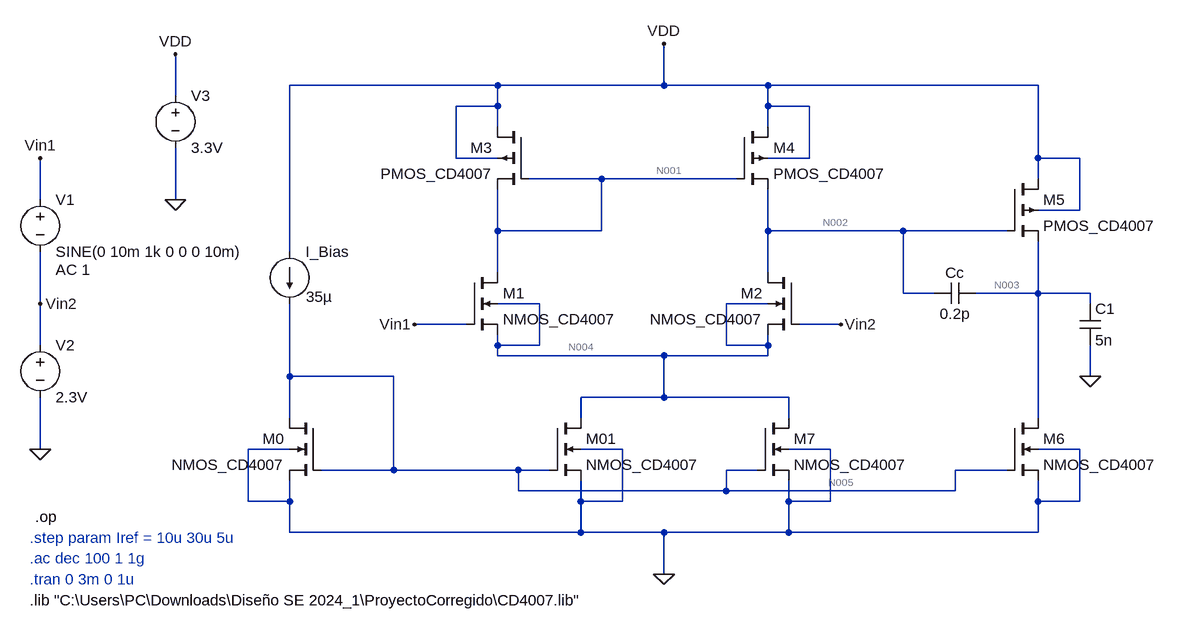
[diagram p0: schematic OTA_ADD_CurrentMirror.asc]
OTA_ADD_CurrentMirror.asc, the LTspice schematic file:
Version 4
SHEET 1 1976 948
WIRE 928 -64 608 -64
WIRE 1184 -64 1184 -128
WIRE 1184 -64 928 -64
WIRE 1344 -64 1184 -64
WIRE 1760 -64 1344 -64
WIRE 432 -48 432 -112
WIRE 928 -32 928 -64
WIRE 928 -32 864 -32
WIRE 1344 -32 1344 -64
WIRE 1408 -32 1344 -32
WIRE 928 0 928 -32
WIRE 1344 0 1344 -32
WIRE 864 48 864 -32
WIRE 928 48 864 48
WIRE 1408 48 1408 -32
WIRE 1408 48 1344 48
WIRE 1760 48 1760 -64
WIRE 1824 48 1760 48
WIRE 1088 80 976 80
WIRE 1296 80 1088 80
WIRE 1760 80 1760 48
WIRE 224 112 224 48
WIRE 432 112 432 32
WIRE 1824 128 1824 48
WIRE 1824 128 1760 128
WIRE 928 160 928 96
WIRE 1088 160 1088 80
WIRE 1088 160 928 160
WIRE 1344 160 1344 96
WIRE 1552 160 1344 160
WIRE 1712 160 1552 160
WIRE 608 192 608 -64
WIRE 928 224 928 160
WIRE 1344 224 1344 160
WIRE 1552 256 1552 160
WIRE 1600 256 1552 256
WIRE 1760 256 1760 176
WIRE 1760 256 1664 256
WIRE 1840 256 1760 256
WIRE 224 272 224 192
WIRE 992 272 928 272
WIRE 1344 272 1280 272
WIRE 1840 272 1840 256
WIRE 880 304 800 304
WIRE 1456 304 1392 304
WIRE 224 336 224 272
WIRE 928 336 928 320
WIRE 992 336 992 272
WIRE 992 336 928 336
WIRE 1280 336 1280 272
WIRE 1344 336 1344 320
WIRE 1344 336 1280 336
WIRE 928 352 928 336
WIRE 1184 352 928 352
WIRE 1344 352 1344 336
WIRE 1344 352 1184 352
WIRE 608 384 608 272
WIRE 768 384 608 384
WIRE 1840 384 1840 336
WIRE 1184 416 1184 352
WIRE 1184 416 1056 416
WIRE 1376 416 1184 416
WIRE 608 448 608 384
WIRE 1056 448 1056 416
WIRE 1376 448 1376 416
WIRE 1760 448 1760 256
WIRE 224 496 224 416
WIRE 608 496 544 496
WIRE 1120 496 1056 496
WIRE 1440 496 1376 496
WIRE 1824 496 1760 496
WIRE 768 528 768 384
WIRE 768 528 656 528
WIRE 960 528 768 528
WIRE 1008 528 960 528
WIRE 1328 528 1280 528
WIRE 1712 528 1632 528
WIRE 960 560 960 528
WIRE 1280 560 1280 528
WIRE 1280 560 960 560
WIRE 1632 560 1632 528
WIRE 1632 560 1280 560
WIRE 544 576 544 496
WIRE 608 576 608 544
WIRE 608 576 544 576
WIRE 1056 576 1056 544
WIRE 1120 576 1120 496
WIRE 1120 576 1056 576
WIRE 1376 576 1376 544
WIRE 1440 576 1440 496
WIRE 1440 576 1376 576
WIRE 1760 576 1760 544
WIRE 1824 576 1824 496
WIRE 1824 576 1760 576
WIRE 608 624 608 576
WIRE 1056 624 1056 576
WIRE 1056 624 608 624
WIRE 1184 624 1056 624
WIRE 1376 624 1376 576
WIRE 1376 624 1184 624
WIRE 1760 624 1760 576
WIRE 1760 624 1376 624
WIRE 1184 688 1184 624
FLAG 1184 -128 VDD
FLAG 432 -112 VDD
FLAG 800 304 Vin1
FLAG 224 48 Vin1
FLAG 1456 304 Vin2
FLAG 224 272 Vin2
FLAG 432 112 0
FLAG 1184 688 0
FLAG 224 496 0
FLAG 1840 384 0
DATAFLAG 1184 352 ""
DATAFLAG 928 160 ""
DATAFLAG 1344 160 ""
DATAFLAG 608 384 ""
DATAFLAG 1280 560 ""
DATAFLAG 1536 160 ""
DATAFLAG 848 304 ""
DATAFLAG 1424 304 ""
DATAFLAG 1760 256 ""
SYMBOL nmos4 880 224 R0
SYMATTR InstName M1
SYMATTR Value NMOS_CD4007
SYMATTR Value2 L=5u W=170u Ad=8500p As=8500p Pd=440u Ps=440u NRD=0.1 NRS=0.1
SYMBOL nmos4 1392 224 M0
SYMATTR InstName M2
SYMATTR Value NMOS_CD4007
SYMATTR Value2 L=5u W=170u Ad=8500p As=8500p Pd=440u Ps=440u NRD=0.1 NRS=0.1
SYMBOL pmos4 976 0 M0
SYMATTR InstName M3
SYMATTR Value PMOS_CD4007
SYMATTR Value2 L=5u W=360u Ad=18000p As=18000p Pd=820u Ps=820u NRS=0.54 NRD=0.54
SYMBOL pmos4 1296 0 R0
SYMATTR InstName M4
SYMATTR Value PMOS_CD4007
SYMATTR Value2 L=5u W=360u Ad=18000p As=18000p Pd=820u Ps=820u NRS=0.54 NRD=0.54
SYMBOL pmos4 1712 80 R0
SYMATTR InstName M5
SYMATTR Value PMOS_CD4007
SYMATTR Value2 L=5u W=360u Ad=18000p As=18000p Pd=820u Ps=820u NRS=0.54 NRD=0.54
SYMBOL nmos4 1712 448 R0
SYMATTR InstName M6
SYMATTR Value NMOS_CD4007
SYMATTR Value2 L=5u W=170u Ad=8500p As=8500p Pd=440u Ps=440u NRD=0.1 NRS=0.1
SYMBOL nmos4 1328 448 R0
SYMATTR InstName M7
SYMATTR Value NMOS_CD4007
SYMATTR Value2 L=5u W=170u Ad=8500p As=8500p Pd=440u Ps=440u NRD=0.1 NRS=0.1
SYMBOL nmos4 656 448 M0
SYMATTR InstName M0
SYMATTR Value NMOS_CD4007
SYMATTR Value2 L=5u W=170u Ad=8500p As=8500p Pd=440u Ps=440u NRD=0.1 NRS=0.1
SYMBOL nmos4 1008 448 R0
SYMATTR InstName M01
SYMATTR Value NMOS_CD4007
SYMATTR Value2 L=5u W=170u Ad=8500p As=8500p Pd=440u Ps=440u NRD=0.1 NRS=0.1
SYMBOL cap 1664 240 R90
WINDOW 0 0 32 VBottom 2
WINDOW 3 32 32 VTop 2
SYMATTR InstName Cc
SYMATTR Value 0.2p
SYMBOL current 608 192 R0
WINDOW 3 25 69 Left 2
WINDOW 123 0 0 Left 0
WINDOW 39 0 0 Left 0
SYMATTR Value 35µ
SYMATTR InstName I_Bias
SYMBOL voltage 224 96 R0
WINDOW 123 24 124 Left 2
WINDOW 39 0 0 Left 0
SYMATTR Value2 AC 1
SYMATTR InstName V1
SYMATTR Value SINE(0 10m 1k 0 0 0 10m)
SYMBOL voltage 224 320 R0
WINDOW 123 24 124 Left 2
WINDOW 39 0 0 Left 0
SYMATTR InstName V2
SYMATTR Value 2.3V
SYMBOL voltage 432 -64 R0
WINDOW 123 0 0 Left 0
WINDOW 39 0 0 Left 0
SYMATTR InstName V3
SYMATTR Value 3.3V
SYMBOL cap 1824 272 R0
SYMATTR InstName C1
SYMATTR Value 5n
TEXT 208 728 Left 2 !.lib "C:\\Users\\PC\\Downloads\\Diseño SE 2024_1\\ProyectoCorregido\\CD4007.lib"
TEXT 208 696 Left 2 ;.tran 0 3m 0 1u
TEXT 208 664 Left 2 ;.ac dec 100 1 1g
TEXT 208 632 Left 2 ;.step param Iref = 10u 30u 5u
TEXT 216 600 Left 2 !.op

The netlist it stands for:
* OTA_ADD_CurrentMirror.asc
M1 N001 Vin1 N004 N004 NMOS_CD4007 L=5u W=170u Ad=8500p As=8500p Pd=440u Ps=440u NRD=0.1 NRS=0.1
M2 N002 Vin2 N004 N004 NMOS_CD4007 L=5u W=170u Ad=8500p As=8500p Pd=440u Ps=440u NRD=0.1 NRS=0.1
M3 VDD N001 N001 VDD PMOS_CD4007 L=5u W=360u Ad=18000p As=18000p Pd=820u Ps=820u NRS=0.54 NRD=0.54
M4 VDD N001 N002 VDD PMOS_CD4007 L=5u W=360u Ad=18000p As=18000p Pd=820u Ps=820u NRS=0.54 NRD=0.54
M5 VDD N002 N003 VDD PMOS_CD4007 L=5u W=360u Ad=18000p As=18000p Pd=820u Ps=820u NRS=0.54 NRD=0.54
M6 N003 N005 0 0 NMOS_CD4007 L=5u W=170u Ad=8500p As=8500p Pd=440u Ps=440u NRD=0.1 NRS=0.1
M7 N004 N005 0 0 NMOS_CD4007 L=5u W=170u Ad=8500p As=8500p Pd=440u Ps=440u NRD=0.1 NRS=0.1
M0 N005 N005 0 0 NMOS_CD4007 L=5u W=170u Ad=8500p As=8500p Pd=440u Ps=440u NRD=0.1 NRS=0.1
M01 N004 N005 0 0 NMOS_CD4007 L=5u W=170u Ad=8500p As=8500p Pd=440u Ps=440u NRD=0.1 NRS=0.1
Cc N003 N002 0.2p
I_Bias VDD N005 35µ
V1 Vin1 Vin2 SINE(0 10m 1k 0 0 0 10m) AC 1
V2 Vin2 0 2.3V
V3 VDD 0 3.3V
C1 N003 0 5n
.model NMOS NMOS
.model PMOS PMOS
.lib standard.mos
.lib "C:\Users\PC\Downloads\Diseño SE 2024_1\ProyectoCorregido\CD4007.lib"
* .tran 0 3m 0 1u
* .ac dec 100 1 1g
* .step param Iref = 10u 30u 5u
.op
.backanno
.end

* Results of the author's LTspice run, read from the files saved beside the schematic
* Operating Point:
*   V(n001) = 1.452 V
*   V(vin1) = 2.3 V
*   V(n004) = 674.1 mV
*   V(n002) = 1.452 V
*   V(vin2) = 2.3 V
*   V(vdd) = 3.3 V
*   V(n003) = 1.059 V
*   V(n005) = 1.627 V
*   Id(M1) = 32.75 µA
*   Ig(M1) = 0 A
*   Ib(M1) = -15.35 pA
*   Is(M1) = -32.75 µA
*   Id(M2) = 32.75 µA
*   Ig(M2) = 0 A
*   Ib(M2) = -15.35 pA
*   Is(M2) = -32.75 µA
*   Id(M6) = 33.72 µA
*   Ig(M6) = 0 A
*   Ib(M6) = -15.64 pA
*   Is(M6) = -33.72 µA
*   Id(M7) = 32.75 µA
*   Ig(M7) = 0 A
*   Ib(M7) = -15.24 pA
*   Is(M7) = -32.75 µA
*   Id(M0) = 35 µA
*   Ig(M0) = 0 A
*   Ib(M0) = -16.22 pA
*   Is(M0) = -35 µA
*   Id(M01) = 32.75 µA
*   Ig(M01) = 0 A
*   Ib(M01) = -15.24 pA
*   Is(M01) = -32.75 µA
*   Id(M3) = 32.75 µA
*   Ig(M3) = 0 A
*   Ib(M3) = 42.76 pA
*   Is(M3) = -32.75 µA
*   Id(M4) = 32.75 µA
*   Ig(M4) = 0 A
*   Ib(M4) = 42.76 pA
*   Is(M4) = -32.75 µA
*   Id(M5) = 33.72 µA
*   Ig(M5) = 0 A
*   Ib(M5) = 43.42 pA
*   Is(M5) = -33.72 µA
*   I(Cc) = 0 A
*   I(C1) = 0 A
*   I(I_bias) = 35 µA
*   I(V1) = 0 A
*   I(V2) = 0 A
*   I(V3) = -134.2 µA
* From the log:
*   Semiconductor Device Operating Points:
*                           --- BSIM3 MOSFETS ---
*   Name:        m1          m2          m6          m7          m0
*   Model:   nmos_cd4007 nmos_cd4007 nmos_cd4007 nmos_cd4007 nmos_cd4007
*   Id:        3.28e-05    3.28e-05    3.37e-05    3.28e-05    3.50e-05
*   Vgs:       1.63e+00    1.63e+00    1.63e+00    1.63e+00    1.63e+00
*   Vds:       7.78e-01    7.78e-01    1.06e+00    6.74e-01    1.63e+00
*   Vbs:       0.00e+00    0.00e+00    0.00e+00    0.00e+00    0.00e+00
*   Vth:       1.42e+00    1.42e+00    1.42e+00    1.42e+00    1.42e+00
*   Vdsat:     1.84e-01    1.84e-01    1.85e-01    1.85e-01    1.86e-01
*   Gm:        2.95e-04    2.95e-04    3.02e-04    2.93e-04    3.12e-04
*   Gds:       2.58e-06    2.58e-06    2.39e-06    2.72e-06    2.18e-06
*   Gmb        1.10e-04    1.10e-04    1.12e-04    1.09e-04    1.16e-04
*   Cbd:       4.15e-14    4.15e-14    3.85e-14    4.29e-14    3.40e-14
*   Cbs:       5.60e-14    5.60e-14    5.60e-14    5.60e-14    5.60e-14
*   Cgsov:     6.53e-14    6.53e-14    6.53e-14    6.53e-14    6.53e-14
*   Cgdov:     6.53e-14    6.53e-14    6.53e-14    6.53e-14    6.53e-14
*   Cgbov:     2.76e-15    2.76e-15    2.76e-15    2.76e-15    2.76e-15
*   dQgdVgb:   4.96e-13    4.96e-13    4.96e-13    4.96e-13    4.96e-13
*   dQgdVdb:  -6.52e-14   -6.52e-14   -6.51e-14   -6.53e-14   -6.51e-14
*   dQgdVsb:  -3.94e-13   -3.94e-13   -3.94e-13   -3.94e-13   -3.94e-13
*   dQddVgb:  -1.90e-13   -1.90e-13   -1.90e-13   -1.90e-13   -1.90e-13
*   dQddVdb:   1.07e-13    1.07e-13    1.04e-13    1.08e-13    9.92e-14
*   dQddVsb:   1.75e-13    1.75e-13    1.75e-13    1.75e-13    1.75e-13
*   dQbdVgb:  -5.39e-14   -5.39e-14   -5.39e-14   -5.38e-14   -5.40e-14
*   dQbdVdb:  -4.15e-14   -4.15e-14   -3.85e-14   -4.29e-14   -3.40e-14
*   dQbdVsb:  -1.65e-13   -1.65e-13   -1.65e-13   -1.65e-13   -1.65e-13
*   Name:        m01         m3          m4          m5
*   Model:   nmos_cd4007 pmos_cd4007 pmos_cd4007 pmos_cd4007
*   Id:        3.28e-05    3.28e-05    3.28e-05    3.37e-05
*   Vgs:       1.63e+00    0.00e+00   -4.22e-14    3.93e-01
*   Vds:       6.74e-01    1.85e+00    1.85e+00    2.24e+00
*   Vbs:       0.00e+00    1.85e+00    1.85e+00    2.24e+00
*   Vth:       1.42e+00   -1.61e+00   -1.61e+00   -1.61e+00
*   Vdsat:     1.85e-01   -2.09e-01   -2.09e-01   -2.10e-01
*   Gm:        2.93e-04    2.79e-04    2.79e-04    2.85e-04
*   Gds:       2.72e-06    2.79e-06    2.79e-06    2.84e-06
*   Gmb        1.09e-04    4.66e-05    4.66e-05    4.70e-05
*   Cbd:       4.29e-14    9.78e-14    9.78e-14    9.78e-14
*   Cbs:       5.60e-14    5.74e-14    5.74e-14    5.37e-14
*   Cgsov:     6.53e-14    1.77e-13    1.77e-13    1.77e-13
*   Cgdov:     6.53e-14    1.77e-13    1.77e-13    1.77e-13
*   Cgbov:     2.76e-15    1.72e-15    1.72e-15    1.72e-15
*   dQgdVgb:   4.96e-13    8.33e-13    8.33e-13    8.33e-13
*   dQgdVdb:  -6.53e-14   -1.75e-13   -1.75e-13   -1.75e-13
*   dQgdVsb:  -3.94e-13   -5.67e-13   -5.67e-13   -5.66e-13
*   dQddVgb:  -1.90e-13   -3.42e-13   -3.42e-13   -3.42e-13
*   dQddVdb:   1.08e-13    2.74e-13    2.74e-13    2.74e-13
*   dQddVsb:   1.75e-13    1.98e-13    1.98e-13    1.98e-13
*   dQbdVgb:  -5.38e-14   -6.78e-14   -6.78e-14   -6.78e-14
*   dQbdVdb:  -4.29e-14   -9.72e-14   -9.72e-14   -9.72e-14
*   dQbdVsb:  -1.65e-13   -1.63e-13   -1.63e-13   -1.59e-13